# Altium schematic sheet ScreenAdapterBoard.SchDoc
size A4
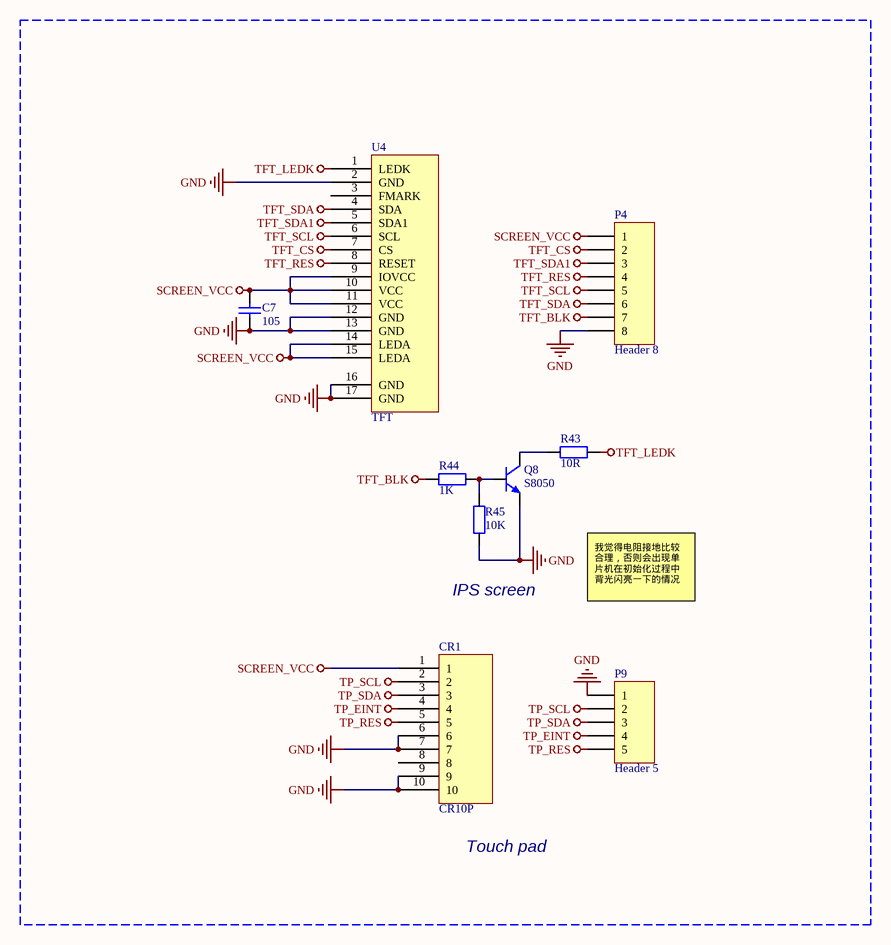
[diagram p0: ScreenAdapterBoard.SchDoc]

## Parts
C7  105  [电容_C0603]
CR1  CR10P  [CONN RCPT 10POS 0.4MM]
P4  Header 8  [HDR1X8]
P9  Header 5  [HDR1X5]
Q8  S8050  [三极管_SOT-23]
R43  10R  [电阻_R0603]
R44  1K  [电阻_R0603]
R45  10K  [电阻_R0603]
U4  TFT  [FPC-0.30mm-15P]

## Nets
GND: C7.2 CR1.6 CR1.7 CR1.9 CR1.10 P4.8 P9.1 Q8.3(E) R45.1 U4.2(GND) U4.12(GND) U4.13(GND) U4.16(GND) U4.17(GND)
SCREEN_VCC: C7.1 CR1.1 P4.1 U4.9(IOVCC) U4.10(VCC) U4.11(VCC) U4.14(LEDA) U4.15(LEDA)
TFT_BLK: P4.7 R44.1
TFT_CS: P4.2 U4.7(CS)
TFT_LEDK: R43.2 U4.1(LEDK)
TFT_RES: P4.4 U4.8(RESET)
TFT_SCL: P4.5 U4.6(SCL)
TFT_SDA: P4.6 U4.4(SDA)
TFT_SDA1: P4.3 U4.5(SDA1)
TP_EINT: CR1.4 P9.4
TP_RES: CR1.5 P9.5
TP_SCL: CR1.2 P9.2
TP_SDA: CR1.3 P9.3
NetQ8_1: Q8.1(B) R44.2 R45.2
NetQ8_2: Q8.2(C) R43.1

Not connected (* = marked no-connect by the designer): CR1 8; U4 3(FMARK)

## Notes on the sheet
- IPS screen
- 我觉得电阻接地比较合理，否则会出现单片机在初始化过程中背光闪亮一下的情况
- Touch pad

## Library data of the parts
C7 = cap: U: 50V; 参数: Cap,0805,X7R,104K,50V,125C,±10%; C: 105
CR1 = CONN RCPT 10P: 板对板连接器
P4 = Header 8: Header, 8-Pin; LatestRevisionDate: 17-Jul-2002; LatestRevisionNote: Re-released for DXP Platform.; Publisher: Altium Limited
P9 = Header 5: Header, 5-Pin; LatestRevisionDate: 17-Jul-2002; LatestRevisionNote: Re-released for DXP Platform.; Publisher: Altium Limited
Q8 = Triode-NPN: _Comma: ,; _Current: 500mA; _Footprint: SOT-23; _Name: Triode; _Specification: Triode,NPN,S8050,SOT-23,500mA,40V; _Voltage: 40V; _Polarity: NPN; _Model: S8050
R43 = Res: _Accuracy: 1%; _Power: 1/8W; _Footprint: 0805; _Drift: 100ppm; _Comma: ,; _Specification: Res,0805,10R,1%,1/8W,100ppm; _Name: Res; _Value: 10R
R44 = Res: _Accuracy: 1%; _Power: 1/8W; _Footprint: 0805; _Drift: 100ppm; _Comma: ,; _Specification: Res,0805,1K,1%,1/8W,100ppm; _Name: Res; _Value: 1K
R45 = Res: _Accuracy: 1%; _Power: 1/8W; _Footprint: 0805; _Drift: 100ppm; _Comma: ,; _Specification: Res,0805,10K,1%,1/8W,100ppm; _Name: Res; _Value: 10K
U4 = TFT_IPS1-1.54寸240*240-AML015410V1: IPS电容式触摸屏